# Altium project KaRadioWired.PrjPcb (part 2 of 2)
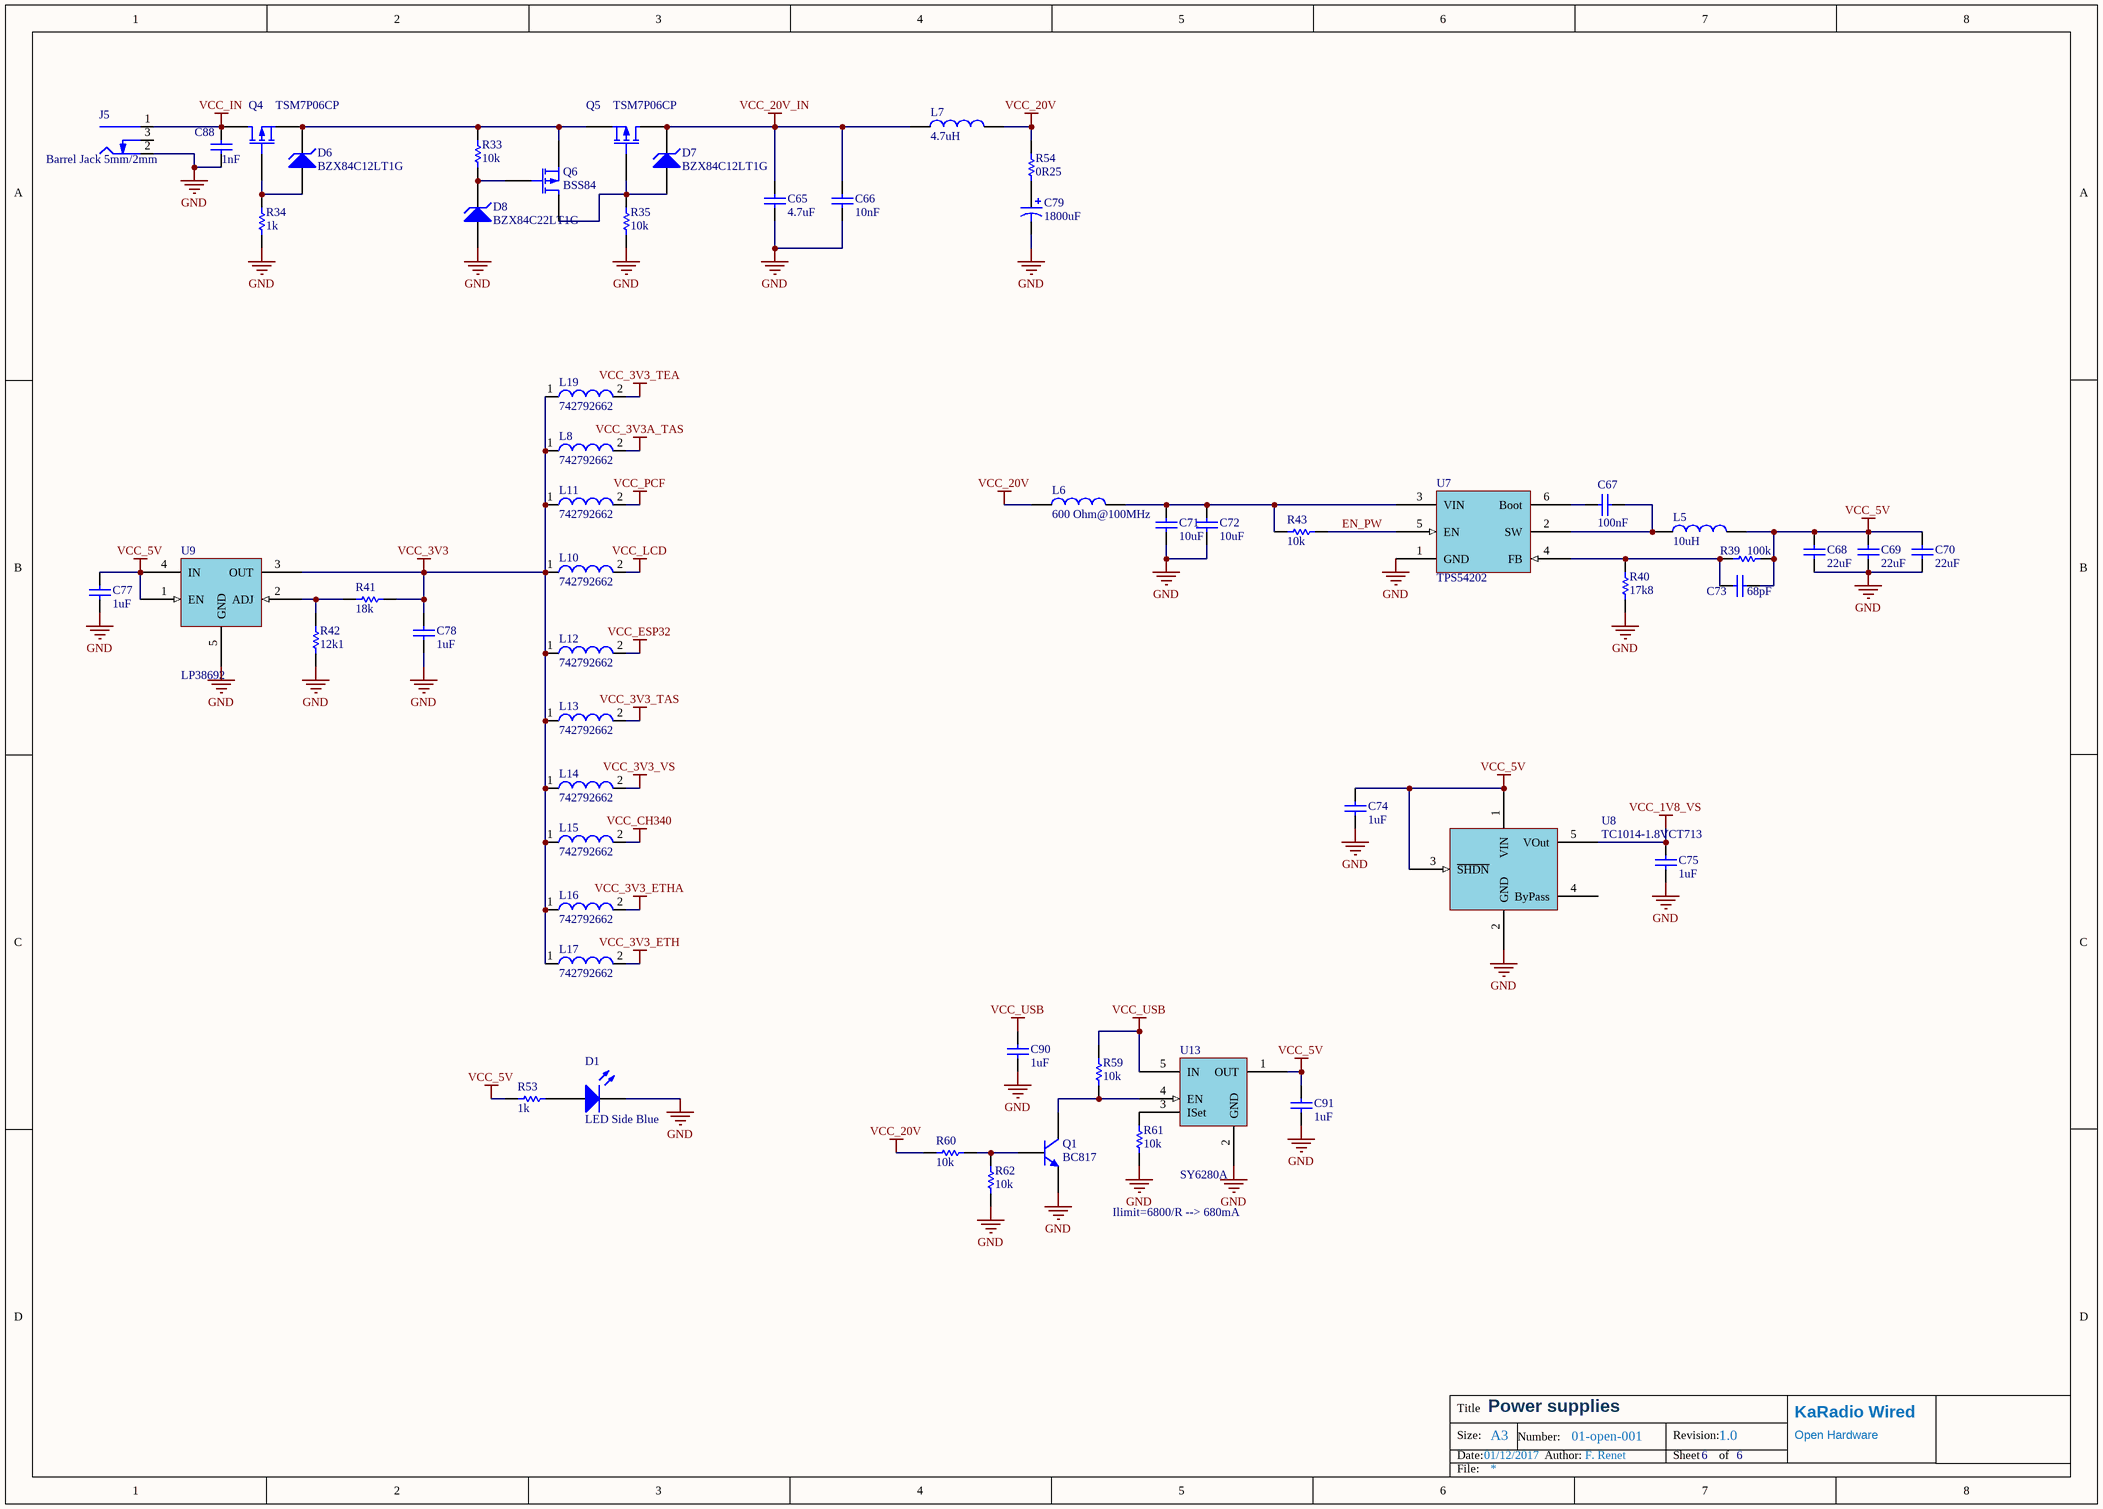
[diagram p6: 05-Power.SchDoc]

## Nets that join several sheets
GND: 00-INDEX (6 pins), 01-Amplifier (37 pins), 02-ESP-WROOM-32 (71 pins), 03-VS1053B (24 pins), 04-Ethernet (13 pins), 05-Power (29 pins)
VCC_1V8_VS: 03-VS1053B (8 pins), 05-Power (C75.2 U8.5)
VCC_3V3: 00-INDEX (TP18.1), 02-ESP-WROOM-32 (U12.3), 05-Power (13 pins)
VCC_3V3_ETH: 04-Ethernet (C43.1 U4.9), 05-Power (L17.2)
VCC_3V3_ETHA: 04-Ethernet (13 pins), 05-Power (L16.2)
VCC_3V3_TAS: 01-Amplifier (C9.2 C10.2 U1.33), 05-Power (L13.2)
VCC_3V3_TEA: 03-VS1053B (C60.2 C61.2 M2.5), 05-Power (L19.2)
VCC_3V3_VS: 03-VS1053B (11 pins), 05-Power (L14.2)
VCC_3V3A_TAS: 01-Amplifier (C11.2 C12.2 U1.18), 05-Power (L8.2)
VCC_5V: 00-INDEX (TP35.1), 02-ESP-WROOM-32 (C64.2 U6.1), 05-Power (15 pins)
VCC_20V: 00-INDEX (TP36.1), 01-Amplifier (8 pins), 02-ESP-WROOM-32 (R55.2), 05-Power (L6.1 L7.2 R54.2 R60.2)
VCC_CH340: 02-ESP-WROOM-32 (C39.1 C40.1 U2.5 U2.19), 05-Power (L15.2)
VCC_ESP32: 02-ESP-WROOM-32 (6 pins), 05-Power (L12.2)
VCC_LCD: 02-ESP-WROOM-32 (16 pins), 05-Power (L10.2)
VCC_PCF: 02-ESP-WROOM-32 (C80.1 U10.5), 05-Power (L11.2)
VCC_USB: 02-ESP-WROOM-32 (D3.4 J4.1), 05-Power (C90.2 R59.2 U13.5)
Audio_Jack_Det: 00-INDEX (TP19.1), 02-ESP-WROOM-32 (U10.14), 03-VS1053B (C24.2 R5.1)
ESP32_EN: 00-INDEX (TP40.1), 02-ESP-WROOM-32 (M1.3 Q2.3 U12.2)
ESP32_IO0: 00-INDEX (TP16.1), 02-ESP-WROOM-32 (M1.25 Q3.3 U5.10 U10.1)
ESP32_RXD: 00-INDEX (TP41.1), 02-ESP-WROOM-32 (M1.34 R24.2)
ESP32_TXD: 00-INDEX (TP42.1), 02-ESP-WROOM-32 (M1.35 R25.2)
Eth_CLK: 00-INDEX (TP34.1), 02-ESP-WROOM-32 (M1.28), 04-Ethernet (R31.1)
Eth_CRS_DV: 00-INDEX (TP30.1), 02-ESP-WROOM-32 (M1.12), 04-Ethernet (U4.11)
Eth_MDC: 00-INDEX (TP32.1), 02-ESP-WROOM-32 (M1.8), 04-Ethernet (U4.13)
Eth_MDIO: 00-INDEX (TP31.1), 02-ESP-WROOM-32 (M1.24), 04-Ethernet (U4.12)
Eth_nRST: 00-INDEX (TP33.1), 02-ESP-WROOM-32 (U10.11), 04-Ethernet (U4.15)
Eth_RXD0: 00-INDEX (TP28.1), 02-ESP-WROOM-32 (M1.10), 04-Ethernet (U4.8)
Eth_RXD1: 00-INDEX (TP29.1), 02-ESP-WROOM-32 (M1.11), 04-Ethernet (U4.7)
Eth_TXD0: 00-INDEX (TP25.1), 02-ESP-WROOM-32 (M1.31), 04-Ethernet (U4.17)
Eth_TXD1: 00-INDEX (TP26.1), 02-ESP-WROOM-32 (M1.36), 04-Ethernet (U4.18)
Eth_TXEN: 00-INDEX (TP27.1), 02-ESP-WROOM-32 (M1.33), 04-Ethernet (U4.16)
IN_VS: 02-ESP-WROOM-32 (J8.4), 03-VS1053B (R57.1 R58.1)
LCD_CS: 00-INDEX (TP15.1), 02-ESP-WROOM-32 (M1.37 R32.1 TP48.1)
LCD_DAT-INS: 00-INDEX (TP13.1), 02-ESP-WROOM-32 (M1.30 R29.1 TP46.1)
LCD_nReset: 00-INDEX (TP11.1), 02-ESP-WROOM-32 (J1.10 U10.12)
LRCLK: 00-INDEX (TP5.1), 01-Amplifier (U1.25), 03-VS1053B (U3.36)
MCLK: 00-INDEX (TP6.1), 01-Amplifier (U1.20), 03-VS1053B (U3.25)
MISO: 02-ESP-WROOM-32 (J1.33 M1.4 TP43.1), 03-VS1053B (U3.30)
MOSI: 00-INDEX (TP12.1), 02-ESP-WROOM-32 (M1.26 R28.1), 03-VS1053B (U3.29)
PWM_LCD: 00-INDEX (TP17.1), 02-ESP-WROOM-32 (M1.9 R52.2 U6.3)
SCL: 00-INDEX (TP9.1), 01-Amplifier (U1.29), 02-ESP-WROOM-32 (5 pins), 03-VS1053B (M2.2)
SCLK: 00-INDEX (TP7.1), 01-Amplifier (U1.26), 03-VS1053B (U3.11)
SDA: 00-INDEX (TP10.1), 01-Amplifier (U1.28), 02-ESP-WROOM-32 (5 pins), 03-VS1053B (M2.1)
SDATA: 00-INDEX (TP8.1), 01-Amplifier (U1.27), 03-VS1053B (U3.12)
SPI_SCLK: 00-INDEX (TP14.1), 02-ESP-WROOM-32 (M1.27 R30.1), 03-VS1053B (U3.28)
TAS_nFAULT: 00-INDEX (TP3.1), 01-Amplifier (U1.19), 02-ESP-WROOM-32 (U10.19)
TAS_nPDN: 00-INDEX (TP4.1), 01-Amplifier (R50.1 U1.24), 02-ESP-WROOM-32 (U10.17)
TAS_nRST: 00-INDEX (TP2.1), 01-Amplifier (U1.31), 02-ESP-WROOM-32 (U10.16)
VS_CS: 00-INDEX (TP22.1), 02-ESP-WROOM-32 (M1.23), 03-VS1053B (U3.23)
VS_DCS: 00-INDEX (TP21.1), 02-ESP-WROOM-32 (M1.29), 03-VS1053B (U3.13)
VS_DREQ: 00-INDEX (TP23.1), 02-ESP-WROOM-32 (M1.5), 03-VS1053B (U3.8)
VS_nRESET: 00-INDEX (TP20.1), 02-ESP-WROOM-32 (U10.10), 03-VS1053B (R51.2 U3.3)